# Altium schematic sheet Rectifier.SchDoc
size A4; DocumentNumber: 1; SheetNumber: 1; SheetTotal: 2
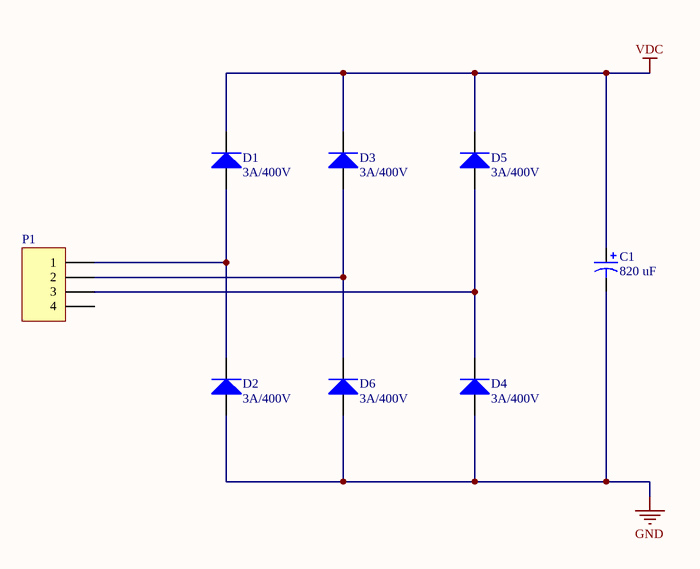
[diagram p0: Rectifier.SchDoc]

## Parts
C1  value 820 uF  [ESMQ401VSN821MA45S]  (hidden comment: ESMQ401VSN821MA45S)
D1  value 3A/400V  [DO201AD]  (hidden comment: DIODE GEN PURP 400V 3A DO201AD - 1N5404)
D2  value 3A/400V  [DO201AD]  (hidden comment: DIODE GEN PURP 400V 3A DO201AD - 1N5404)
D3  value 3A/400V  [DO201AD]  (hidden comment: DIODE GEN PURP 400V 3A DO201AD - 1N5404)
D4  value 3A/400V  [DO201AD]  (hidden comment: DIODE GEN PURP 400V 3A DO201AD - 1N5404)
D5  value 3A/400V  [DO201AD]  (hidden comment: DIODE GEN PURP 400V 3A DO201AD - 1N5404)
D6  value 3A/400V  [DO201AD]  (hidden comment: DIODE GEN PURP 400V 3A DO201AD - 1N5404)
P1  CTB9358/4AO  [CTB9350/4AO]  (value not drawn)

## Nets
GND: C1.2 D2.1(A) D4.1(A) D6.1(A)
VDC: C1.1 D1.2(K) D3.2(K) D5.2(K)
NetD1_1: D1.1(A) D2.2(K) P1.1
NetD3_1: D3.1(A) D6.2(K) P1.2
NetD4_2: D4.2(K) D5.1(A) P1.3

Not connected (* = marked no-connect by the designer): P1 4

## Library data of the parts
C1 = ESMQ401VSN821MA45S: CAP ALUM 820UF 20% 400V SNAP; Published: 25.10.2016; LatestRevisionDate: -; Publisher: Baris; PackageDescription: Polarized Capacitor; 2 Leads; Supplier: Digikey; Supplier No: 565-2783-ND
D1-D6 = DIODE GEN PURP 400V 3A DO201AD - 1N5404: DIODE GEN PURP 400V 3A DO201AD; Manufacturer: DIODES INC.; Manufacturer Part Name: 1N5404-T; Code: 3040173; Family: DIODE; Package Reference: DO201AD; Supplier: Digikey; Supplier No: 1N5404DITR-ND
P1 = CTB9358/4AO: 4 pos plıggable terminal; LatestRevisionDate: 19.05.2016; Publisher: Sinan